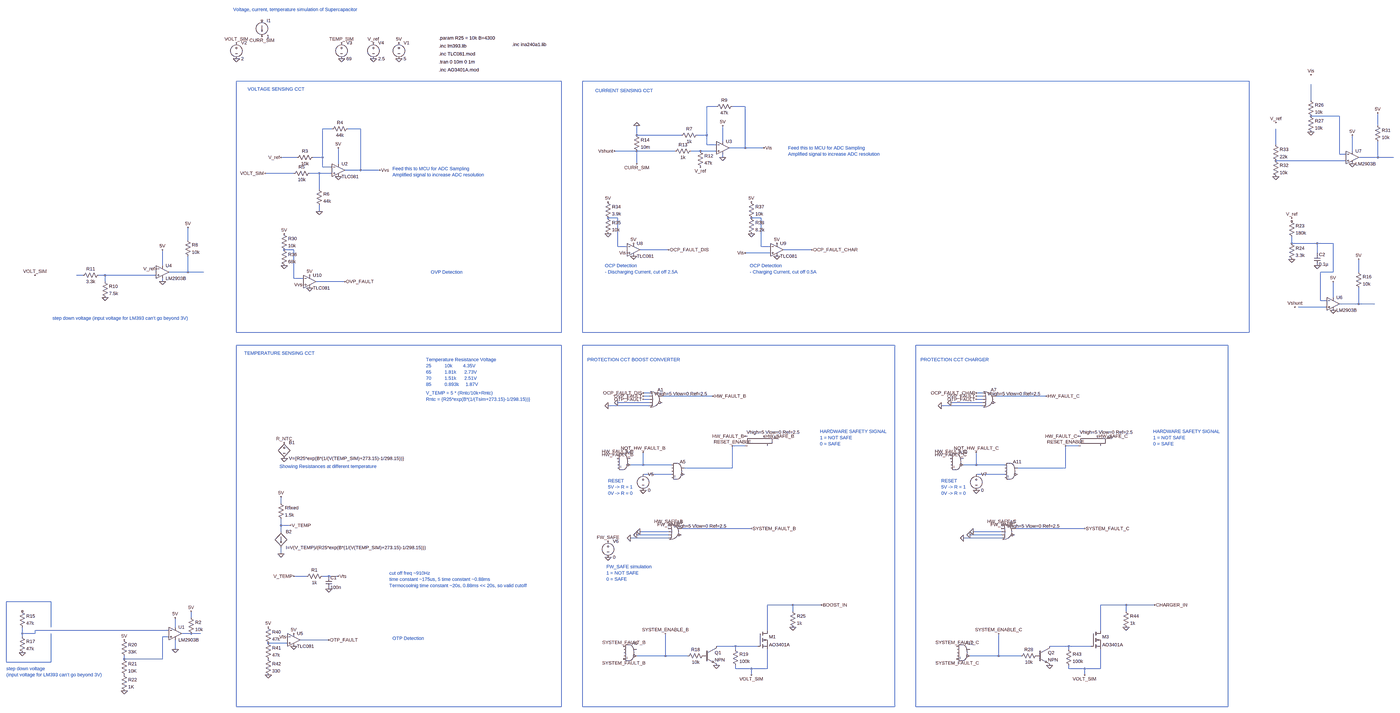
[diagram p0: schematic TempSensing.asc, whole sheet]
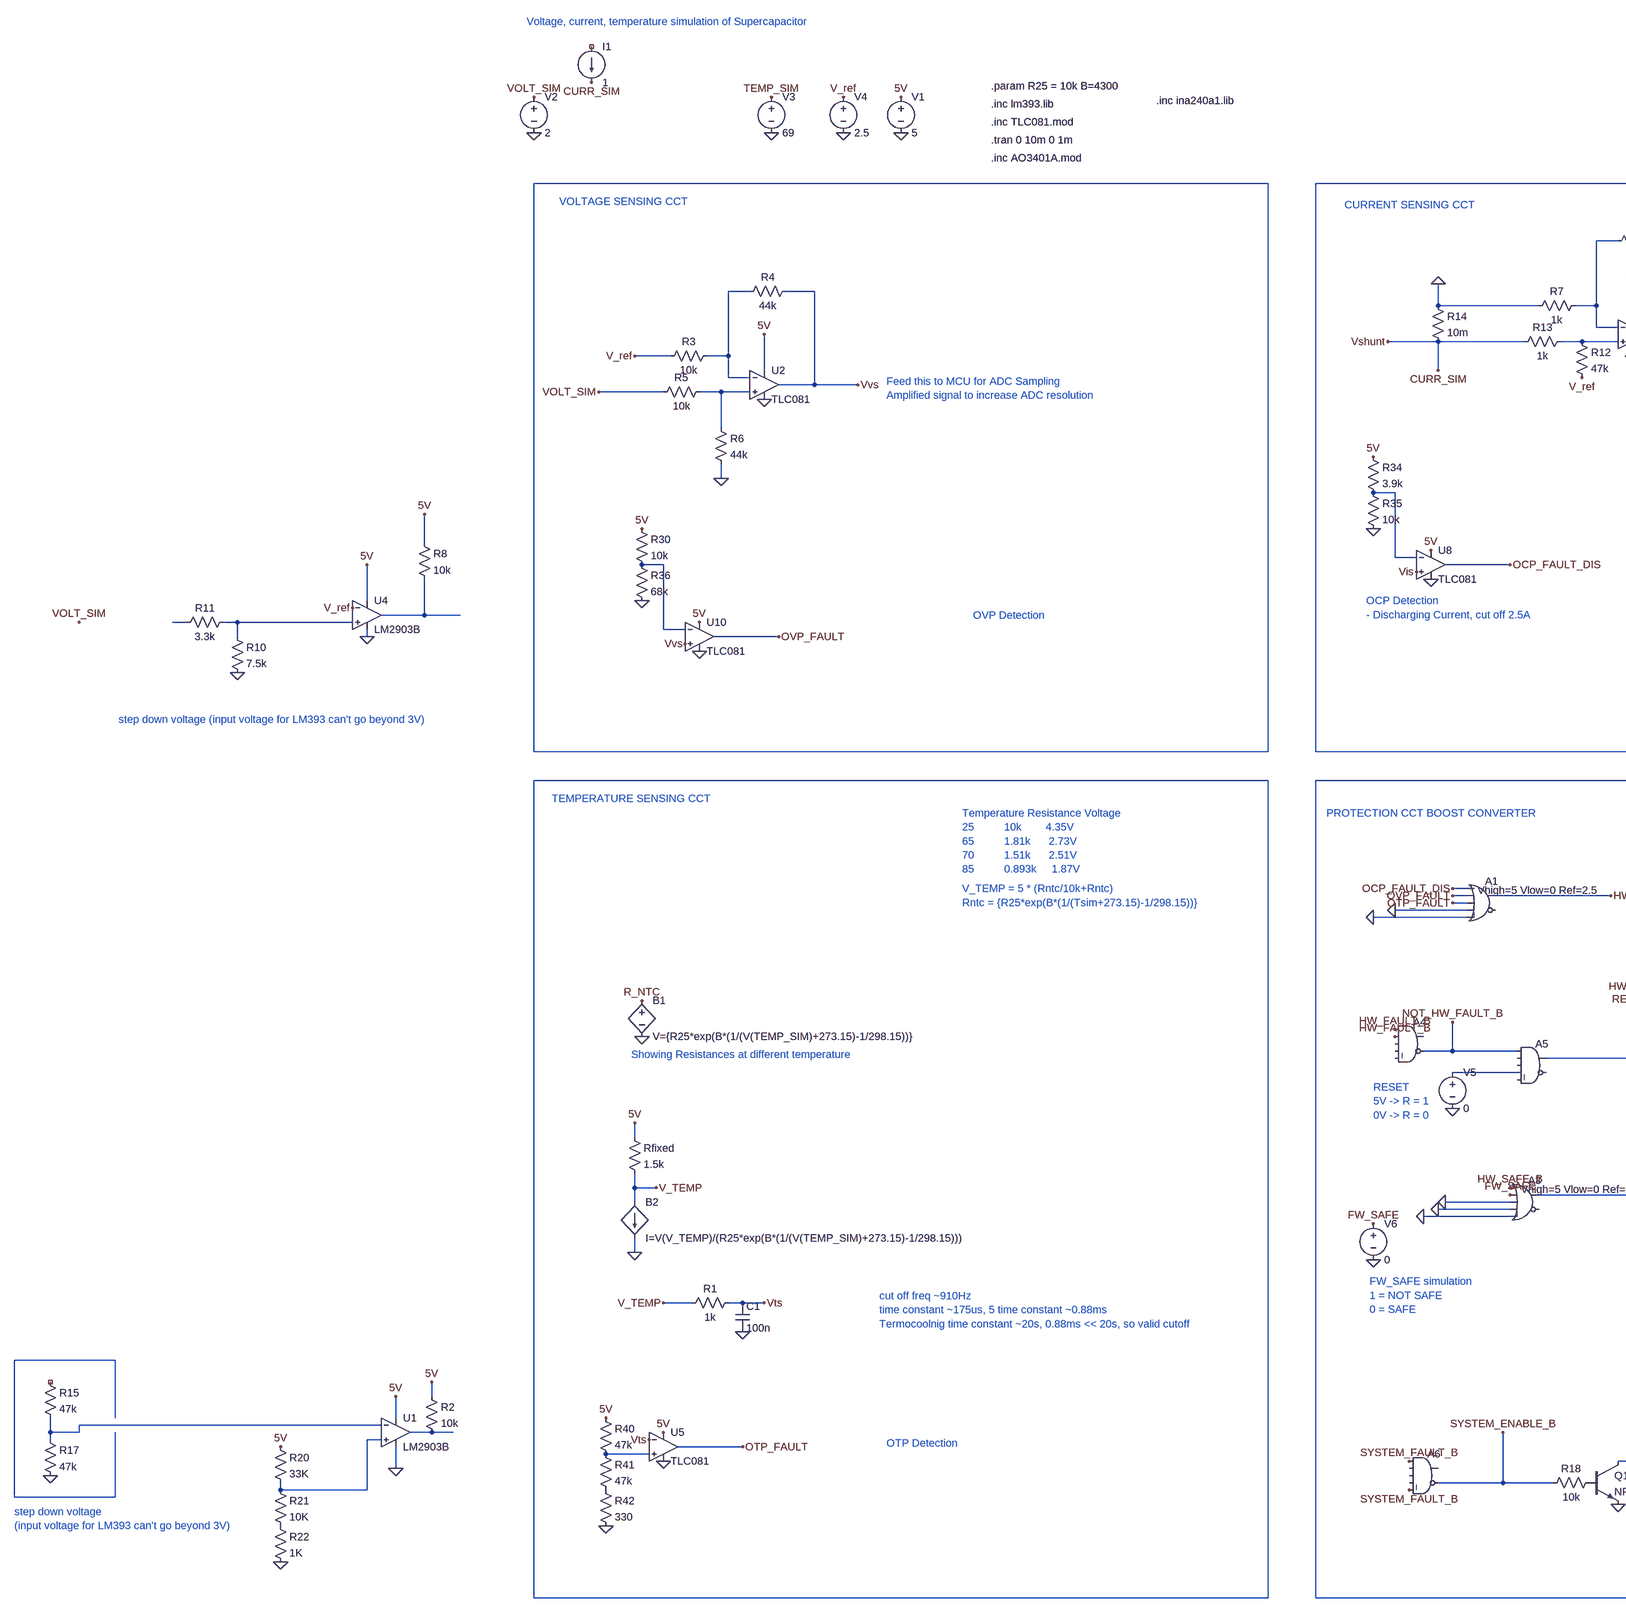
[diagram p1: schematic TempSensing.asc, part, row 1 of 1, column 1 of 2]
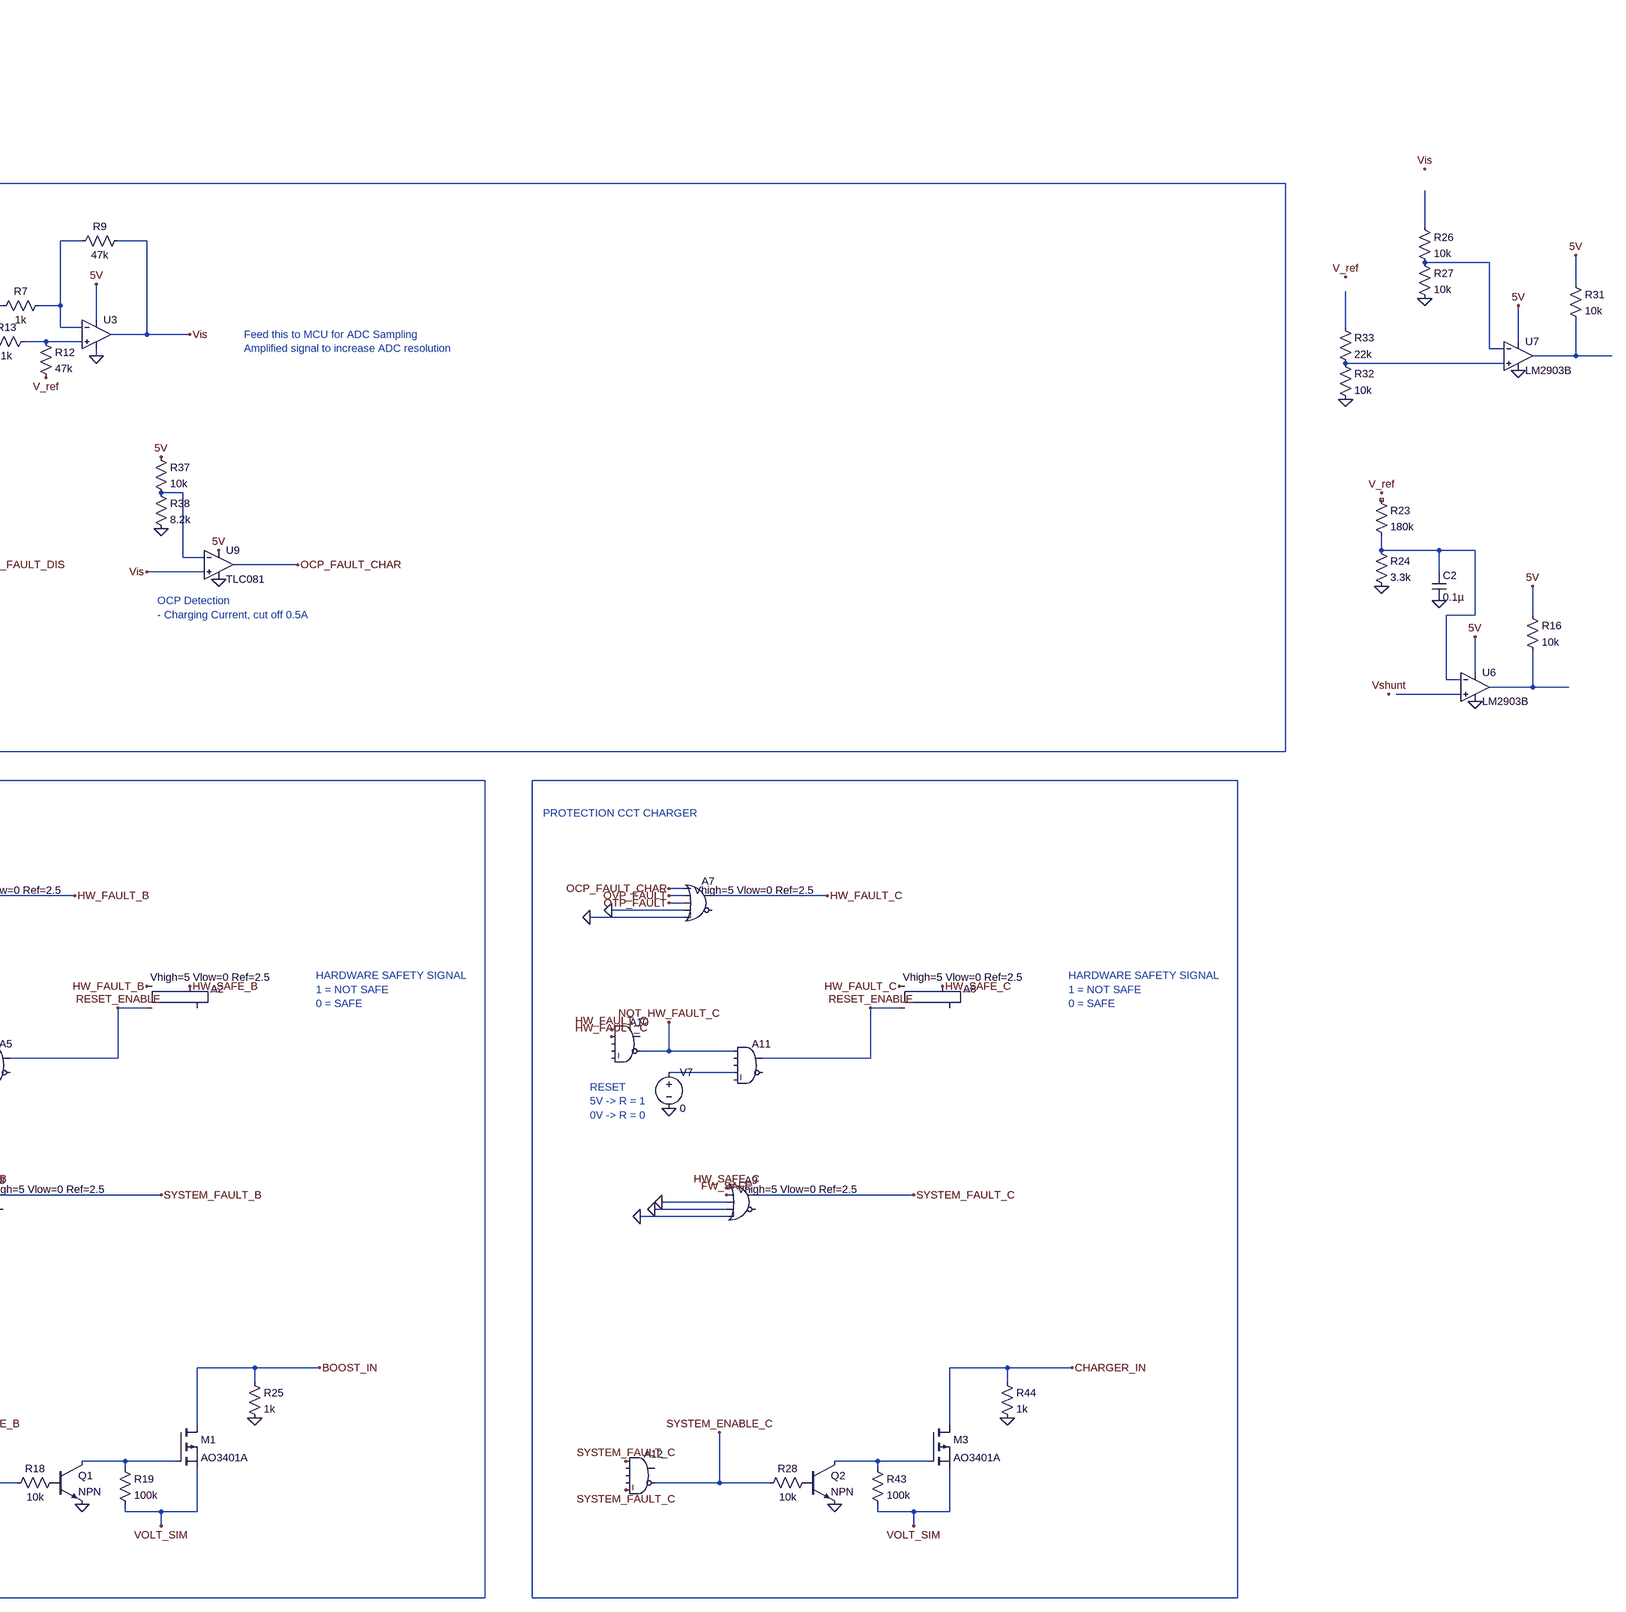
[diagram p2: schematic TempSensing.asc, part, row 1 of 1, column 2 of 2]
TempSensing.asc, the LTspice schematic file:
Version 4.1
SHEET 1 6484 816
WIRE 880 -2352 -752 -2352
WIRE 5696 -2352 1008 -2352
WIRE 6064 -2256 6064 -2336
WIRE 1680 -2224 1632 -2224
WIRE 1824 -2224 1760 -2224
WIRE 6208 -2176 6064 -2176
WIRE 6400 -2128 6400 -2192
WIRE -272 -2112 -320 -2112
WIRE -128 -2112 -192 -2112
WIRE 1280 -2080 1280 -2128
WIRE 1504 -2080 1280 -2080
WIRE 1632 -2080 1632 -2224
WIRE 1632 -2080 1584 -2080
WIRE 1712 -2048 1712 -2128
WIRE 1632 -2032 1632 -2080
WIRE 1680 -2032 1632 -2032
WIRE 5888 -2032 5888 -2112
WIRE 1824 -2016 1824 -2224
WIRE 1824 -2016 1744 -2016
WIRE 1920 -2016 1824 -2016
WIRE 1280 -2000 1168 -2000
WIRE 1472 -2000 1280 -2000
WIRE 1600 -2000 1552 -2000
WIRE 1680 -2000 1600 -2000
WIRE 6272 -2000 6272 -2080
WIRE 6208 -1984 6208 -2176
WIRE 6240 -1984 6208 -1984
WIRE -448 -1968 -528 -1968
WIRE -320 -1968 -320 -2112
WIRE -320 -1968 -368 -1968
WIRE 1712 -1968 1712 -1984
WIRE 6400 -1968 6400 -2048
WIRE 6400 -1968 6304 -1968
WIRE 6480 -1968 6400 -1968
WIRE 6240 -1952 5888 -1952
WIRE -240 -1936 -240 -2016
WIRE 1280 -1936 1280 -2000
WIRE -320 -1920 -320 -1968
WIRE -272 -1920 -320 -1920
WIRE -128 -1904 -128 -2112
WIRE -128 -1904 -208 -1904
WIRE -32 -1904 -128 -1904
WIRE -464 -1888 -608 -1888
WIRE -336 -1888 -384 -1888
WIRE -272 -1888 -336 -1888
WIRE -336 -1808 -336 -1888
WIRE -336 -1696 -336 -1728
WIRE 1184 -1664 1136 -1664
WIRE 1904 -1664 1856 -1664
WIRE -1072 -1552 -1072 -1616
WIRE 5968 -1536 5968 -1568
WIRE 6096 -1536 5968 -1536
WIRE 6176 -1536 6096 -1536
WIRE 1184 -1520 1184 -1664
WIRE 1232 -1520 1184 -1520
WIRE 1904 -1520 1904 -1664
WIRE 1952 -1520 1904 -1520
WIRE -464 -1504 -512 -1504
WIRE 1440 -1504 1296 -1504
WIRE 2160 -1504 2016 -1504
WIRE 1952 -1488 1824 -1488
WIRE 6096 -1488 6096 -1536
WIRE -1200 -1424 -1200 -1504
WIRE -1072 -1392 -1072 -1472
WIRE -1072 -1392 -1168 -1392
WIRE -992 -1392 -1072 -1392
WIRE 6176 -1392 6176 -1536
WIRE 6176 -1392 6112 -1392
WIRE 6304 -1392 6304 -1456
WIRE -1600 -1376 -1632 -1376
WIRE -1488 -1376 -1520 -1376
WIRE -1232 -1376 -1488 -1376
WIRE -464 -1360 -464 -1504
WIRE -416 -1360 -464 -1360
WIRE -1488 -1344 -1488 -1376
WIRE -1200 -1344 -1200 -1360
WIRE -208 -1344 -352 -1344
WIRE 6176 -1264 6176 -1344
WIRE 6112 -1248 6112 -1392
WIRE 6144 -1248 6112 -1248
WIRE 6304 -1232 6304 -1312
WIRE 6304 -1232 6208 -1232
WIRE 6384 -1232 6304 -1232
WIRE 6144 -1216 6000 -1216
WIRE -752 -1088 -752 -2352
WIRE 880 -1088 880 -2352
WIRE 880 -1088 -752 -1088
WIRE 1008 -1088 1008 -2352
WIRE 5696 -1088 5696 -2352
WIRE 5696 -1088 1008 -1088
WIRE 880 -1024 -752 -1024
WIRE 2576 -1024 1008 -1024
WIRE 4336 -1024 2768 -1024
WIRE 1344 -784 1312 -784
WIRE 3104 -784 3072 -784
WIRE 1344 -768 1312 -768
WIRE 1664 -768 1408 -768
WIRE 3104 -768 3072 -768
WIRE 3424 -768 3168 -768
WIRE 1344 -752 1312 -752
WIRE 3104 -752 3072 -752
WIRE 1344 -736 1184 -736
WIRE 3104 -736 2944 -736
WIRE 1344 -720 1136 -720
WIRE 3104 -720 2896 -720
WIRE 1824 -512 1760 -512
WIRE 3584 -512 3520 -512
WIRE 1312 -416 1312 -480
WIRE 1312 -416 1248 -416
WIRE 1456 -416 1312 -416
WIRE 3072 -416 3072 -480
WIRE 3072 -416 3008 -416
WIRE 3216 -416 3072 -416
WIRE 1760 -400 1760 -512
WIRE 1760 -400 1520 -400
WIRE 3520 -400 3520 -512
WIRE 3520 -400 3280 -400
WIRE 1456 -368 1312 -368
WIRE 3216 -368 3072 -368
WIRE -528 -224 -528 -256
WIRE -528 -112 -528 -144
WIRE -480 -112 -528 -112
WIRE 1856 -96 1504 -96
WIRE 3616 -96 3264 -96
WIRE -528 -80 -528 -112
WIRE 1440 -80 1296 -80
WIRE 3200 -80 3056 -80
WIRE 1440 -64 1280 -64
WIRE 3200 -64 3040 -64
WIRE 1440 -48 1248 -48
WIRE 3200 -48 3008 -48
WIRE -528 32 -528 0
WIRE -400 144 -464 144
WIRE -288 144 -320 144
WIRE -240 144 -288 144
WIRE -1760 272 -1984 272
WIRE 2064 288 1936 288
WIRE 2208 288 2064 288
WIRE 3824 288 3696 288
WIRE 3968 288 3824 288
WIRE 2064 320 2064 288
WIRE 3824 320 3824 288
WIRE -1056 352 -1056 320
WIRE -1760 400 -1760 272
WIRE -1136 400 -1136 352
WIRE -1168 416 -1840 416
WIRE 1936 416 1936 288
WIRE 3696 416 3696 288
WIRE -1904 432 -1904 400
WIRE -1840 432 -1840 416
WIRE -1840 432 -1904 432
WIRE -1056 432 -1104 432
WIRE -1008 432 -1056 432
WIRE -1904 448 -1904 432
WIRE -1168 448 -1200 448
WIRE -288 464 -432 464
WIRE -496 480 -592 480
WIRE 1776 496 1680 496
WIRE 1888 496 1776 496
WIRE 3536 496 3440 496
WIRE 3648 496 3536 496
WIRE -1136 512 -1136 464
WIRE 1776 512 1776 496
WIRE 3536 512 3536 496
WIRE 1424 544 1424 432
WIRE 1424 544 1280 544
WIRE 1536 544 1424 544
WIRE 3184 544 3184 432
WIRE 3184 544 3040 544
WIRE 3296 544 3184 544
WIRE -1392 560 -1392 544
WIRE -1200 560 -1200 448
WIRE -1200 560 -1392 560
WIRE -1984 576 -1984 272
WIRE -1760 576 -1760 432
WIRE -1760 576 -1984 576
WIRE 1776 608 1776 592
WIRE 1856 608 1776 608
WIRE 1936 608 1936 512
WIRE 1936 608 1856 608
WIRE 3536 608 3536 592
WIRE 3616 608 3536 608
WIRE 3696 608 3696 512
WIRE 3696 608 3616 608
WIRE 1856 640 1856 608
WIRE 3616 640 3616 608
WIRE -752 800 -752 -1024
WIRE 880 800 880 -1024
WIRE 880 800 -752 800
WIRE 1008 800 1008 -1024
WIRE 2576 800 2576 -1024
WIRE 2576 800 1008 800
WIRE 2768 800 2768 -1024
WIRE 4336 800 4336 -1024
WIRE 4336 800 2768 800
FLAG 64 -2544 5V
FLAG 64 -2464 0
FLAG -528 -256 5V
FLAG -528 32 0
FLAG -480 -112 V_TEMP
FLAG -512 -528 R_NTC
FLAG -512 -448 0
FLAG -288 208 0
FLAG -464 144 V_TEMP
FLAG -240 144 Vts
FLAG -64 -2464 0
FLAG -64 -2544 V_ref
FLAG -1136 352 5V
FLAG -1136 512 0
FLAG -1056 320 5V
FLAG -240 -2016 5V
FLAG -240 -1872 0
FLAG -336 -1696 0
FLAG -32 -1904 Vvs
FLAG -528 -1968 V_ref
FLAG -1200 -1504 5V
FLAG -1072 -1616 5V
FLAG -1200 -1344 0
FLAG -224 -2464 0
FLAG -224 -2544 TEMP_SIM
FLAG -1232 -1408 V_ref
FLAG -608 -1888 VOLT_SIM
FLAG -752 -2544 VOLT_SIM
FLAG -752 -2464 0
FLAG -1488 -1264 0
FLAG -1840 -1376 VOLT_SIM
FLAG 1712 -2128 5V
FLAG 1920 -2016 Vis
FLAG 1600 -1920 V_ref
FLAG 1712 -1968 0
FLAG 1280 -2128 0
FLAG 1280 -1936 CURR_SIM
FLAG 6176 -1344 5V
FLAG 6304 -1456 5V
FLAG 6096 -1424 0
FLAG 6176 -1200 0
FLAG -624 -2576 CURR_SIM
FLAG 1184 -736 0
FLAG 1312 -784 OCP_FAULT_DIS
FLAG 1312 -768 OVP_FAULT
FLAG 1312 -752 OTP_FAULT
FLAG 1664 -768 HW_FAULT_B
FLAG 1136 -720 0
FLAG -1904 528 0
FLAG -1392 464 5V
FLAG -1392 720 0
FLAG 5968 -1456 0
FLAG 5968 -1664 V_ref
FLAG 1824 -560 HW_FAULT_B
FLAG 1920 -560 HW_SAFE_B
FLAG 1312 -288 0
FLAG 1440 -112 HW_SAFE_B
FLAG 1136 -32 FW_SAFE
FLAG 1296 -80 0
FLAG 1280 -64 0
FLAG 1248 -48 0
FLAG 1760 -512 RESET_ENABLE
FLAG 1856 -96 SYSTEM_FAULT_B
FLAG 1136 48 0
FLAG 1440 -96 FW_SAFE
FLAG 1184 -464 HW_FAULT_B
FLAG 1184 -448 HW_FAULT_B
FLAG 1312 -480 NOT_HW_FAULT_B
FLAG 1856 640 VOLT_SIM
FLAG 2208 288 BOOST_IN
FLAG 1680 592 0
FLAG 1424 432 SYSTEM_ENABLE_B
FLAG 2064 400 0
FLAG 1216 496 SYSTEM_FAULT_B
FLAG 1216 560 SYSTEM_FAULT_B
FLAG 1168 -2000 Vshunt
FLAG 5984 -1216 Vshunt
FLAG 6272 -2080 5V
FLAG 6400 -2192 5V
FLAG 6272 -1936 0
FLAG 5888 -1872 0
FLAG 6064 -2384 Vis
FLAG 5888 -2144 V_ref
FLAG 6064 -2096 0
FLAG -464 432 5V
FLAG -464 496 0
FLAG -288 464 OTP_FAULT
FLAG 1264 -1536 5V
FLAG 1264 -1472 0
FLAG 1136 -1744 5V
FLAG 1136 -1584 0
FLAG 1440 -1504 OCP_FAULT_DIS
FLAG 1984 -1536 5V
FLAG 1984 -1472 0
FLAG 1856 -1744 5V
FLAG 1856 -1584 0
FLAG 2160 -1504 OCP_FAULT_CHAR
FLAG 1232 -1488 Vis
FLAG -384 -1376 5V
FLAG -384 -1312 0
FLAG -512 -1584 5V
FLAG -512 -1424 0
FLAG -416 -1328 Vvs
FLAG -208 -1344 OVP_FAULT
FLAG -496 448 Vts
FLAG 2944 -736 0
FLAG 3072 -784 OCP_FAULT_CHAR
FLAG 3072 -768 OVP_FAULT
FLAG 3072 -752 OTP_FAULT
FLAG 3424 -768 HW_FAULT_C
FLAG 2896 -720 0
FLAG 3584 -560 HW_FAULT_C
FLAG 3680 -560 HW_SAFE_C
FLAG 3072 -288 0
FLAG 3200 -112 HW_SAFE_C
FLAG 3056 -80 0
FLAG 3040 -64 0
FLAG 3008 -48 0
FLAG 3520 -512 RESET_ENABLE
FLAG 3616 -96 SYSTEM_FAULT_C
FLAG 3200 -96 FW_SAFE
FLAG 2944 -464 HW_FAULT_C
FLAG 2944 -448 HW_FAULT_C
FLAG 3072 -480 NOT_HW_FAULT_C
FLAG 3440 592 0
FLAG 3184 432 SYSTEM_ENABLE_C
FLAG 2976 496 SYSTEM_FAULT_C
FLAG 2976 560 SYSTEM_FAULT_C
FLAG -592 640 0
FLAG -592 400 5V
FLAG 3616 640 VOLT_SIM
FLAG 3968 288 CHARGER_IN
FLAG 3824 400 0
FLAG 1824 -1488 Vis
DATAFLAG 1280 -2000 ""
DATAFLAG 1824 -2016 ""
DATAFLAG 5968 -1536 ""
DATAFLAG 5888 -1952 ""
SYMBOL res -544 -240 R0
SYMATTR InstName Rfixed
SYMATTR Value 1.5k
SYMBOL voltage 64 -2560 R0
WINDOW 123 0 0 Left 0
WINDOW 39 0 0 Left 0
SYMATTR InstName V1
SYMATTR Value 5
SYMBOL bv -512 -544 R0
SYMATTR InstName B1
SYMATTR Value V={R25*exp(B*(1/(V(TEMP_SIM)+273.15)-1/298.15))}
SYMBOL res -304 128 R90
WINDOW 0 0 56 VBottom 2
WINDOW 3 32 56 VTop 2
SYMATTR InstName R1
SYMATTR Value 1k
SYMBOL cap -304 144 R0
SYMATTR InstName C1
SYMATTR Value 100n
SYMBOL OpAmps\\opamp2 -1136 368 R0
SYMATTR InstName U1
SYMATTR Value LM2903B
SYMBOL res -1072 336 R0
SYMATTR InstName R2
SYMATTR Value 10k
SYMBOL res -352 -1984 R90
WINDOW 0 0 56 VBottom 2
WINDOW 3 32 56 VTop 2
SYMATTR InstName R3
SYMATTR Value 10k
SYMBOL res -176 -2128 R90
WINDOW 0 0 56 VBottom 2
WINDOW 3 32 56 VTop 2
SYMATTR InstName R4
SYMATTR Value 44k
SYMBOL res -368 -1904 R90
WINDOW 0 0 56 VBottom 2
WINDOW 3 32 56 VTop 2
SYMATTR InstName R5
SYMATTR Value 10k
SYMBOL res -352 -1824 R0
SYMATTR InstName R6
SYMATTR Value 44k
SYMBOL res -1088 -1568 R0
SYMATTR InstName R8
SYMATTR Value 10k
SYMBOL OpAmps\\opamp2 -1200 -1456 R0
SYMATTR InstName U4
SYMATTR Value LM2903B
SYMBOL voltage -224 -2560 R0
WINDOW 123 0 0 Left 0
WINDOW 39 0 0 Left 0
SYMATTR InstName V3
SYMATTR Value 69
SYMBOL bi -528 -80 R0
SYMATTR InstName B2
SYMATTR Value I=V(V_TEMP)/(R25*exp(B*(1/(V(TEMP_SIM)+273.15)-1/298.15)))
SYMBOL OpAmps\\opamp2 -240 -1968 R0
SYMATTR InstName U2
SYMATTR Value TLC081
SYMBOL voltage -752 -2560 R0
WINDOW 123 0 0 Left 0
WINDOW 39 0 0 Left 0
SYMATTR InstName V2
SYMATTR Value 2
SYMBOL res -1504 -1360 R0
SYMATTR InstName R10
SYMATTR Value 7.5k
SYMBOL res -1504 -1392 R90
WINDOW 0 0 56 VBottom 2
WINDOW 3 32 56 VTop 2
SYMATTR InstName R11
SYMATTR Value 3.3k
SYMBOL voltage -64 -2560 R0
WINDOW 123 0 0 Left 0
WINDOW 39 0 0 Left 0
SYMATTR InstName V4
SYMATTR Value 2.5
SYMBOL res 1600 -2096 R90
WINDOW 0 0 56 VBottom 2
WINDOW 3 32 56 VTop 2
SYMATTR InstName R7
SYMATTR Value 1k
SYMBOL res 1776 -2240 R90
WINDOW 0 0 56 VBottom 2
WINDOW 3 32 56 VTop 2
SYMATTR InstName R9
SYMATTR Value 47k
SYMBOL res 1584 -2016 R0
SYMATTR InstName R12
SYMATTR Value 47k
SYMBOL res 1568 -2016 R90
WINDOW 0 0 56 VBottom 2
WINDOW 3 32 56 VTop 2
SYMATTR InstName R13
SYMATTR Value 1k
SYMBOL res 1264 -2096 R0
SYMATTR InstName R14
SYMATTR Value 10m
SYMBOL res 6288 -1408 R0
SYMATTR InstName R16
SYMATTR Value 10k
SYMBOL cap 6080 -1488 R0
SYMATTR InstName C2
SYMATTR Value 0.1µ
SYMBOL OpAmps\\opamp2 6176 -1296 R0
SYMATTR InstName U6
SYMATTR Value LM2903B
SYMBOL current -624 -2656 R0
WINDOW 123 0 0 Left 0
WINDOW 39 0 0 Left 0
SYMATTR InstName I1
SYMATTR Value 1
SYMBOL Digital\\or 1376 -816 R0
WINDOW 3 -8 36 Left 2
SYMATTR Value Vhigh=5 Vlow=0 Ref=2.5
SYMATTR InstName A1
SYMBOL res -1920 304 R0
SYMATTR InstName R15
SYMATTR Value 47k
SYMBOL res -1920 432 R0
SYMATTR InstName R17
SYMATTR Value 47k
SYMBOL res -1408 448 R0
SYMATTR InstName R20
SYMATTR Value 33K
SYMBOL res -1408 544 R0
SYMATTR InstName R21
SYMATTR Value 10K
SYMBOL res -1408 624 R0
SYMATTR InstName R22
SYMATTR Value 1K
SYMBOL res 5952 -1664 R0
SYMATTR InstName R23
SYMATTR Value 180k
SYMATTR SpiceLine tol=10
SYMBOL res 5952 -1552 R0
SYMATTR InstName R24
SYMATTR Value 3.3k
SYMATTR SpiceLine tol=10
SYMBOL OpAmps\\UniversalOpAmp 1712 -2016 R0
SYMATTR InstName U3
SYMBOL Digital\\srflop 1872 -608 R0
WINDOW 39 -40 28 Left 2
SYMATTR SpiceLine Vhigh=5 Vlow=0 Ref=2.5
SYMATTR InstName A2
SYMBOL voltage 1312 -384 R0
WINDOW 123 0 0 Left 0
WINDOW 39 0 0 Left 0
SYMATTR InstName V5
SYMATTR Value 0
SYMBOL Digital\\or 1472 -144 R0
WINDOW 3 -8 36 Left 2
SYMATTR Value Vhigh=5 Vlow=0 Ref=2.5
SYMATTR InstName A3
SYMBOL voltage 1136 -48 R0
WINDOW 123 0 0 Left 0
WINDOW 39 0 0 Left 0
SYMATTR InstName V6
SYMATTR Value 0
SYMBOL Digital\\and 1216 -496 R0
SYMATTR InstName A4
SYMBOL Digital\\and 1488 -448 R0
SYMATTR InstName A5
SYMBOL npn 1616 496 R0
SYMATTR InstName Q1
SYMBOL res 1632 528 R90
WINDOW 0 0 56 VBottom 2
WINDOW 3 32 56 VTop 2
SYMATTR InstName R18
SYMATTR Value 10k
SYMBOL res 1760 496 R0
SYMATTR InstName R19
SYMATTR Value 100k
SYMBOL res 2048 304 R0
SYMATTR InstName R25
SYMATTR Value 1k
SYMBOL pmos 1888 416 R0
SYMATTR InstName M1
SYMATTR Value AO3401A
SYMATTR Prefix X
SYMBOL Digital\\and 1248 464 R0
SYMATTR InstName A6
SYMBOL res 6384 -2144 R0
SYMATTR InstName R31
SYMATTR Value 10k
SYMBOL OpAmps\\opamp2 6272 -2032 R0
SYMATTR InstName U7
SYMATTR Value LM2903B
SYMBOL res 5872 -1968 R0
SYMATTR InstName R32
SYMATTR Value 10k
SYMATTR SpiceLine tol=10
SYMBOL res 5872 -2048 R0
SYMATTR InstName R33
SYMATTR Value 22k
SYMATTR SpiceLine tol=10
SYMBOL res 6048 -2272 R0
SYMATTR InstName R26
SYMATTR Value 10k
SYMATTR SpiceLine tol=10
SYMBOL res 6048 -2192 R0
SYMATTR InstName R27
SYMATTR Value 10k
SYMATTR SpiceLine tol=10
SYMBOL OpAmps\\opamp2 -464 400 R0
SYMATTR InstName U5
SYMATTR Value TLC081
SYMBOL OpAmps\\opamp2 1264 -1568 R0
SYMATTR InstName U8
SYMATTR Value TLC081
SYMBOL res 1120 -1760 R0
SYMATTR InstName R34
SYMATTR Value 3.9k
SYMBOL res 1120 -1680 R0
SYMATTR InstName R35
SYMATTR Value 10k
SYMBOL OpAmps\\opamp2 1984 -1568 R0
SYMATTR InstName U9
SYMATTR Value TLC081
SYMBOL res 1840 -1760 R0
SYMATTR InstName R37
SYMATTR Value 10k
SYMBOL res 1840 -1680 R0
SYMATTR InstName R38
SYMATTR Value 8.2k
SYMBOL OpAmps\\opamp2 -384 -1408 R0
SYMATTR InstName U10
SYMATTR Value TLC081
SYMBOL res -528 -1600 R0
SYMATTR InstName R30
SYMATTR Value 10k
SYMBOL res -528 -1520 R0
SYMATTR InstName R36
SYMATTR Value 68k
SYMBOL Digital\\or 3136 -816 R0
WINDOW 3 -8 36 Left 2
SYMATTR Value Vhigh=5 Vlow=0 Ref=2.5
SYMATTR InstName A7
SYMBOL Digital\\srflop 3632 -608 R0
WINDOW 39 -40 28 Left 2
SYMATTR SpiceLine Vhigh=5 Vlow=0 Ref=2.5
SYMATTR InstName A8
SYMBOL voltage 3072 -384 R0
WINDOW 123 0 0 Left 0
WINDOW 39 0 0 Left 0
SYMATTR InstName V7
SYMATTR Value 0
SYMBOL Digital\\or 3232 -144 R0
WINDOW 3 -8 36 Left 2
SYMATTR Value Vhigh=5 Vlow=0 Ref=2.5
SYMATTR InstName A9
SYMBOL Digital\\and 2976 -496 R0
SYMATTR InstName A10
SYMBOL Digital\\and 3248 -448 R0
SYMATTR InstName A11
SYMBOL npn 3376 496 R0
SYMATTR InstName Q2
SYMBOL res 3392 528 R90
WINDOW 0 0 56 VBottom 2
WINDOW 3 32 56 VTop 2
SYMATTR InstName R28
SYMATTR Value 10k
SYMBOL Digital\\and 3008 464 R0
SYMATTR InstName A12
SYMBOL res -608 384 R0
SYMATTR InstName R40
SYMATTR Value 47k
SYMBOL res -608 464 R0
SYMATTR InstName R41
SYMATTR Value 47k
SYMBOL res -608 544 R0
SYMATTR InstName R42
SYMATTR Value 330
SYMBOL res 3520 496 R0
SYMATTR InstName R43
SYMATTR Value 100k
SYMBOL res 3808 304 R0
SYMATTR InstName R44
SYMATTR Value 1k
SYMBOL pmos 3648 416 R0
SYMATTR InstName M3
SYMATTR Value AO3401A
SYMATTR Prefix X
TEXT 264 -2568 Left 2 !.param R25 = 10k B=4300
TEXT -536 -408 Left 2 ;Showing Resistances at different temperature
TEXT 200 -952 Left 2 ;Temperature Resistance Voltage\n25          10k        4.35V\n65          1.81k      2.73V\n70          1.51k      2.51V\n85          0.893k     1.87V
TEXT 200 -784 Left 2 ;V_TEMP = 5 * (Rntc/10k+Rntc)\nRntc = {R25*exp(B*(1/(Tsim+273.15)-1/298.15))}
TEXT 16 128 Left 2 ;cut off freq ~910Hz\ntime constant ~175us, 5 time constant ~0.88ms\nTermocoolnig time constant ~20s, 0.88ms << 20s, so valid cutoff
TEXT 264 -2488 Left 2 !.inc TLC081.mod
TEXT 264 -2528 Left 2 !.inc lm393.lib
TEXT -712 -984 Left 2 ;TEMPERATURE SENSING CCT
TEXT -696 -2312 Left 2 ;VOLTAGE SENSING CCT
TEXT 264 -2448 Left 2 !.tran 0 10m 0 1m
TEXT 32 -1912 Left 2 ;Feed this to MCU for ADC Sampling\nAmplified signal to increase ADC resolution
TEXT 224 -1392 Left 2 ;OVP Detection
TEXT 32 456 Left 2 ;OTP Detection
TEXT 1072 -2304 Left 2 ;CURRENT SENSING CCT
TEXT 2040 -2016 Left 2 ;Feed this to MCU for ADC Sampling\nAmplified signal to increase ADC resolution
TEXT 1120 -1424 Left 2 ;OCP Detection\n- Discharging Current, cut off 2.5A
TEXT 1032 -952 Left 2 ;PROTECTION CCT BOOST CONVERTER
TEXT 2200 -584 Left 2 ;HARDWARE SAFETY SIGNAL\n1 = NOT SAFE\n0 = SAFE
TEXT 1136 -336 Left 2 ;RESET\n5V -> R = 1\n0V -> R = 0
TEXT -1752 -1160 Left 2 ;step down voltage (input voltage for LM393 can't go beyond 3V)
TEXT -1984 608 Left 2 ;step down voltage \n(input voltage for LM393 can't go beyond 3V)
TEXT 1128 96 Left 2 ;FW_SAFE simulation\n1 = NOT SAFE\n0 = SAFE
TEXT -768 -2712 Left 2 ;Voltage, current, temperature simulation of Supercapacitor
TEXT 264 -2408 Left 2 !.inc AO3401A.mod
TEXT 632 -2536 Left 2 !.inc ina240a1.lib
TEXT 1848 -1424 Left 2 ;OCP Detection\n- Charging Current, cut off 0.5A
TEXT 2792 -952 Left 2 ;PROTECTION CCT CHARGER
TEXT 3960 -584 Left 2 ;HARDWARE SAFETY SIGNAL\n1 = NOT SAFE\n0 = SAFE
TEXT 2896 -336 Left 2 ;RESET\n5V -> R = 1\n0V -> R = 0

The netlist it stands for:
* TempSensing.asc
Rfixed 5V V_TEMP 1.5k
V1 5V 0 5
B1 R_NTC 0 V={R25*exp(B*(1/(V(TEMP_SIM)+273.15)-1/298.15))}
R1 Vts V_TEMP 1k
C1 Vts 0 100n
X§U1 N029 N027 5V 0 N028 LM2903B  ; pins In+ In- V+ V- OUT
R2 5V N028 10k
R3 N006 V_ref 10k
R4 Vvs N006 44k
R5 N011 VOLT_SIM 10k
R6 N011 0 44k
R8 5V N016 10k
X§U4 N018 V_ref 5V 0 N016 LM2903B  ; pins In+ In- V+ V- OUT
V3 TEMP_SIM 0 69
B2 V_TEMP 0 I=V(V_TEMP)/(R25*exp(B*(1/(V(TEMP_SIM)+273.15)-1/298.15)))
X§U2 N011 N006 5V 0 Vvs TLC081  ; pins In+ In- V+ V- OUT
V2 VOLT_SIM 0 2
R10 N018 0 7.5k
R11 N018 N017 3.3k
V4 V_ref 0 2.5
R7 N004 0 1k
R9 Vis N004 47k
R12 N008 V_ref 47k
R13 N008 Vshunt 1k
R14 0 Vshunt 10m
R16 5V N019 10k
C2 N014 0 0.1µ
X§U6 N020 N014 5V 0 N019 LM2903B  ; pins In+ In- V+ V- OUT
I1 NC_01 Vshunt 1
A1 OCP_FAULT_DIS OVP_FAULT OTP_FAULT 0 0 0 HW_FAULT_B 0 OR Vhigh=5 Vlow=0 Ref=2.5
R15 NC_02 N027 47k
R17 N027 0 47k
R20 5V N029 33K
R21 N029 P001 10K
R22 P001 0 1K
R23 NC_03 N014 180k tol=10
R24 N014 0 3.3k tol=10
X§U3 N008 N004 5V 0 Vis level1 Avol=1Meg GBW=10Meg Vos=0 En=0 Enk=0 In=0 Ink=0 Rin=500Meg  ; pins In+ In- V+ V- OUT
A2 HW_FAULT_B RESET_ENABLE 0 0 0 0 HW_SAFE_B 0 SRFLOP Vhigh=5 Vlow=0 Ref=2.5
V5 N024 0 0
A3 HW_SAFE_B FW_SAFE 0 0 0 0 SYSTEM_FAULT_B 0 OR Vhigh=5 Vlow=0 Ref=2.5
V6 FW_SAFE 0 0
A4 HW_FAULT_B HW_FAULT_B 0 0 0 NOT_HW_FAULT_B 0 0 AND
A5 NOT_HW_FAULT_B 0 0 N024 0 0 RESET_ENABLE 0 AND
Q1 N031 P002 0 0 NPN
R18 P002 SYSTEM_ENABLE_B 10k
R19 N031 VOLT_SIM 100k
R25 BOOST_IN 0 1k
X§M1 BOOST_IN N031 VOLT_SIM AO3401A  ; pins D G S
A6 SYSTEM_FAULT_B 0 0 0 SYSTEM_FAULT_B SYSTEM_ENABLE_B 0 0 AND
R31 5V N009 10k
X§U7 N010 N005 5V 0 N009 LM2903B  ; pins In+ In- V+ V- OUT
R32 N010 0 10k tol=10
R33 N007 N010 22k tol=10
R26 N003 N005 10k tol=10
R27 N005 0 10k tol=10
X§U5 N030 Vts 5V 0 OTP_FAULT TLC081  ; pins In+ In- V+ V- OUT
X§U8 Vis N012 5V 0 OCP_FAULT_DIS TLC081  ; pins In+ In- V+ V- OUT
R34 5V N012 3.9k
R35 N012 0 10k
X§U9 Vis N013 5V 0 OCP_FAULT_CHAR TLC081  ; pins In+ In- V+ V- OUT
R37 5V N013 10k
R38 N013 0 8.2k
X§U10 Vvs N015 5V 0 OVP_FAULT TLC081  ; pins In+ In- V+ V- OUT
R30 5V N015 10k
R36 N015 0 68k
A7 OCP_FAULT_CHAR OVP_FAULT OTP_FAULT 0 0 0 HW_FAULT_C 0 OR Vhigh=5 Vlow=0 Ref=2.5
A8 HW_FAULT_C RESET_ENABLE 0 0 0 0 HW_SAFE_C 0 SRFLOP Vhigh=5 Vlow=0 Ref=2.5
V7 N025 0 0
A9 HW_SAFE_C FW_SAFE 0 0 0 0 SYSTEM_FAULT_C 0 OR Vhigh=5 Vlow=0 Ref=2.5
A10 HW_FAULT_C HW_FAULT_C 0 0 0 NOT_HW_FAULT_C 0 0 AND
A11 NOT_HW_FAULT_C 0 0 N025 0 0 RESET_ENABLE 0 AND
Q2 N032 P003 0 0 NPN
R28 P003 SYSTEM_ENABLE_C 10k
A12 SYSTEM_FAULT_C 0 0 0 SYSTEM_FAULT_C SYSTEM_ENABLE_C 0 0 AND
R40 5V N030 47k
R41 N030 P004 47k
R42 P004 0 330
R43 N032 VOLT_SIM 100k
R44 CHARGER_IN 0 1k
X§M3 CHARGER_IN N032 VOLT_SIM AO3401A  ; pins D G S
.model NPN NPN
.model PNP PNP
.lib standard.bjt
.param R25 = 10k B=4300
* Showing Resistances at different temperature
* Temperature Resistance Voltage
* 25          10k        4.35V
* 65          1.81k      2.73V
* 70          1.51k      2.51V
* 85          0.893k     1.87V
* V_TEMP = 5 * (Rntc/10k+Rntc)
* Rntc = {R25*exp(B*(1/(Tsim+273.15)-1/298.15))}
* cut off freq ~910Hz
* time constant ~175us, 5 time constant ~0.88ms
* Termocoolnig time constant ~20s, 0.88ms << 20s, so valid cutoff
.inc TLC081.mod
.inc lm393.lib
* TEMPERATURE SENSING CCT
* VOLTAGE SENSING CCT
.tran 0 10m 0 1m
* Feed this to MCU for ADC Sampling
* Amplified signal to increase ADC resolution
* OVP Detection
* OTP Detection
* CURRENT SENSING CCT
* Feed this to MCU for ADC Sampling
* Amplified signal to increase ADC resolution
* OCP Detection
* - Discharging Current, cut off 2.5A
* PROTECTION CCT BOOST CONVERTER
* HARDWARE SAFETY SIGNAL
* 1 = NOT SAFE
* 0 = SAFE
* RESET
* 5V -> R = 1
* 0V -> R = 0
* step down voltage (input voltage for LM393 can't go beyond 3V)
* step down voltage
* (input voltage for LM393 can't go beyond 3V)
* FW_SAFE simulation
* 1 = NOT SAFE
* 0 = SAFE
* Voltage, current, temperature simulation of Supercapacitor
.inc AO3401A.mod
.inc ina240a1.lib
* OCP Detection
* - Charging Current, cut off 0.5A
* PROTECTION CCT CHARGER
* HARDWARE SAFETY SIGNAL
* 1 = NOT SAFE
* 0 = SAFE
* RESET
* 5V -> R = 1
* 0V -> R = 0
.lib UniversalOpAmp1.lib
.backanno
.end